# EAGLE design esphome-schalter-icmodul (EAGLE 9.6.2)
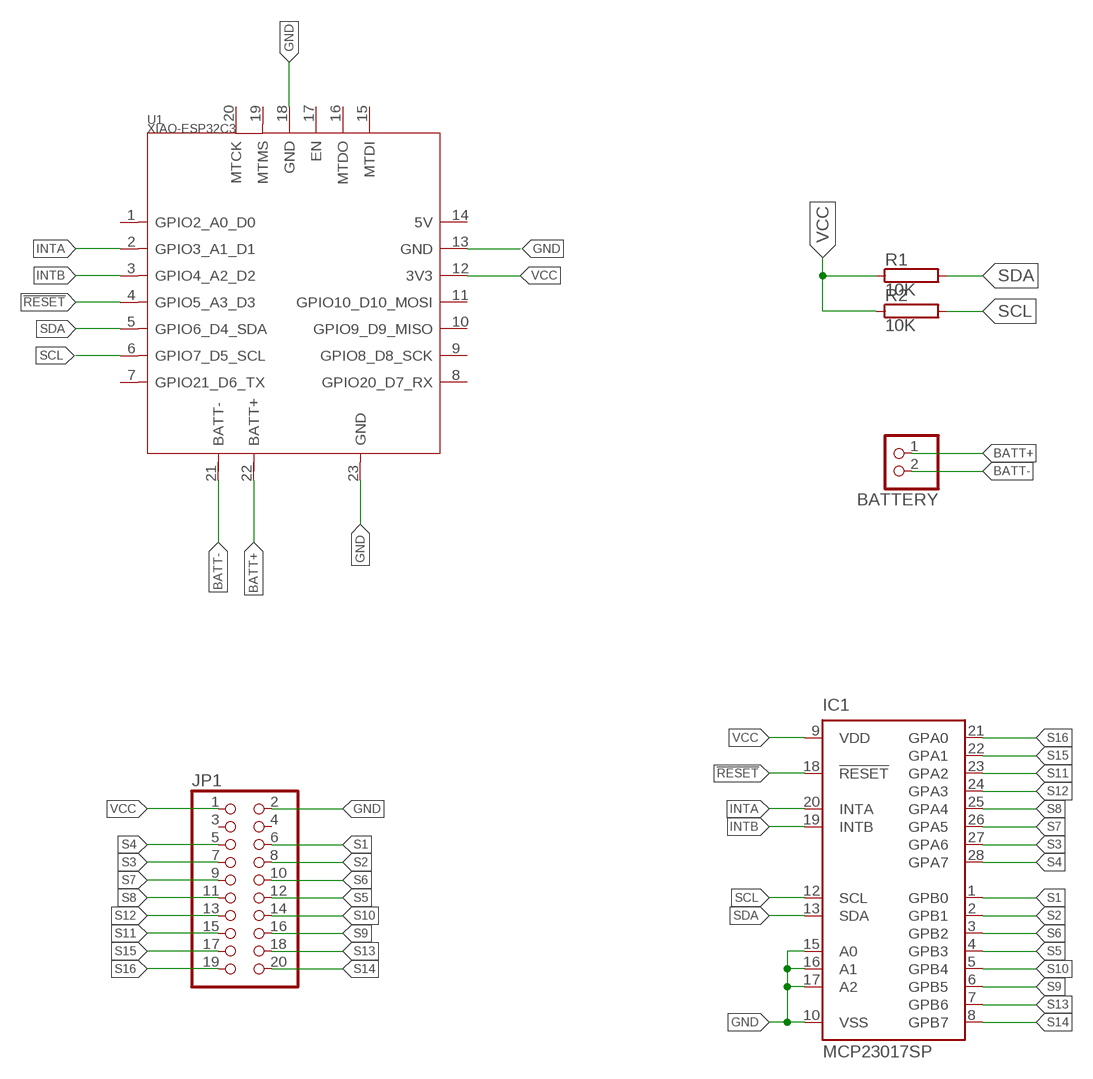
[diagram p0: schematic, sheet 1]

## Parts
BATTERY  JST_2PIN-SMT  [JST-PH-2-SMT]
IC1  MCP23017SP  [DIL28-3]
JP1  PINHD-2X10  [2X10]
R1  10K  RCA0001  [CA0001]
R2  10K  RCA0001  [CA0001]
U1  XIAO-ESP32C3  [XIAO-ESP32C3-MODULE14P-2.54-21X17.8MM]

## Nets
!RESET: IC1.18(!RESET) U1.4(GPIO5_A3_D3)
BATT+: BATTERY.1 U1.22(BATT+)
BATT-: BATTERY.2 U1.21(BATT-)
GND: IC1.10(VSS) IC1.15(A0) IC1.16(A1) IC1.17(A2) JP1.2 U1.13(GND) U1.18(GND) U1.23(GND)
INTA: IC1.20(INTA) U1.2(GPIO3_A1_D1)
INTB: IC1.19(INTB) U1.3(GPIO4_A2_D2)
S1: IC1.1(GPB0) JP1.6
S2: IC1.2(GPB1) JP1.8
S3: IC1.27(GPA6) JP1.7
S4: IC1.28(GPA7) JP1.5
S5: IC1.4(GPB3) JP1.12
S6: IC1.3(GPB2) JP1.10
S7: IC1.26(GPA5) JP1.9
S8: IC1.25(GPA4) JP1.11
S9: IC1.6(GPB5) JP1.16
S10: IC1.5(GPB4) JP1.14
S11: IC1.23(GPA2) JP1.15
S12: IC1.24(GPA3) JP1.13
S13: IC1.7(GPB6) JP1.18
S14: IC1.8(GPB7) JP1.20
S15: IC1.22(GPA1) JP1.17
S16: IC1.21(GPA0) JP1.19
SCL: IC1.12(SCL) R2.2 U1.6(GPIO7_D5_SCL)
SDA: IC1.13(SDA) R1.2 U1.5(GPIO6_D4_SDA)
VCC: IC1.9(VDD) JP1.1 R1.1 R2.1 U1.12(3V3)
Unconnected: JP1.3 JP1.4 U1.1(GPIO2_A0_D0) U1.7(GPIO21_D6_TX) U1.8(GPIO20_D7_RX) U1.9(GPIO8_D8_SCK) U1.10(GPIO9_D9_MISO) U1.11(GPIO10_D10_MOSI) U1.14(5V) U1.15(MTDI) U1.16(MTDO) U1.17(EN) U1.19(MTMS) U1.20(MTCK)

## Library data of the parts
BATTERY = adafruit:JST_2PIN: JST 2-Pin Connectors of various flavors SMT-RA (S2B-PH-SM4) 4UConnector #17311 SMT (B2B-PH-SM4) THM-RA (S2B-PH) THM (B2B-PH)
IC1 = microchip:MCP23017: http://ww1.microchip.com/downloads/en/DeviceDoc/21952a.pdf Source: http://ww1.microchip.com/downloads/en/DeviceDoc/21952a.pdf; MF: MICROCHIP; MPN: MCP23017-E/SP; OC_FARNELL: 1332088; OC_NEWARK: 31K2959
JP1 = pinhead:PINHD-2X10: PIN HEADER
R1 R2 = resistor-power:R: Power Resitor; OC_FARNELL: unknown; OC_NEWARK: unknown
U1 = Seeed Studio XIAO Series:XIAO-ESP32C3: Seeed Studio XIAO ESP32C3 - Espressif ESP32-C3 WiFi BLE Microcontroller - 32-bit 160MHz RISC-V processor Seeed SKU: 113991054 Seeed Studio XIAO ESP32C3 featuring ESP32C3 carries a complete Wi-Fi system along with Bluetooth Low Energy function. With its exquisite design, WiFi+BT ability, it's perfect for various IoT controlling scenarios and complex carriable applications. Buy now <https://www.seeedstudio.com/Seeed-XIAO-ESP32C3-p-5431.html> Wiki <https://wiki.seeedstudio.com/XIAO_ESP32C3_Getting_Started/>

## Board
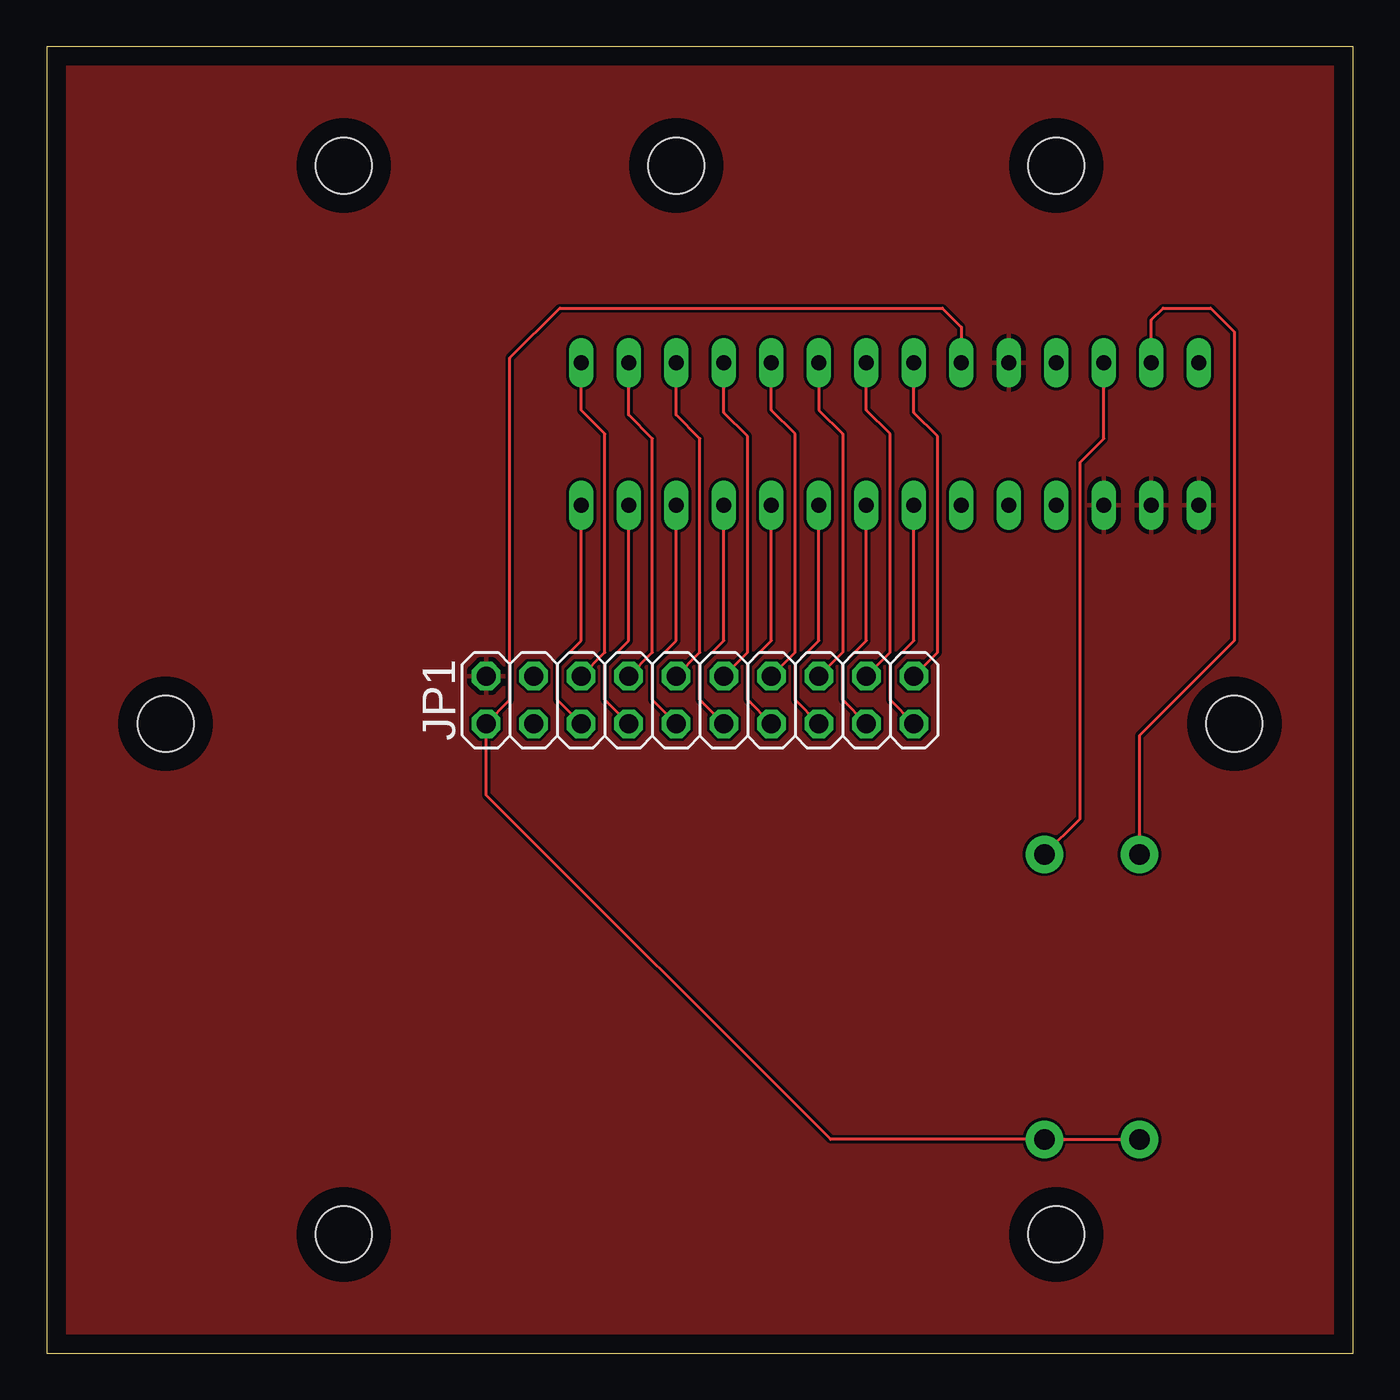
[diagram p1: board, top side]
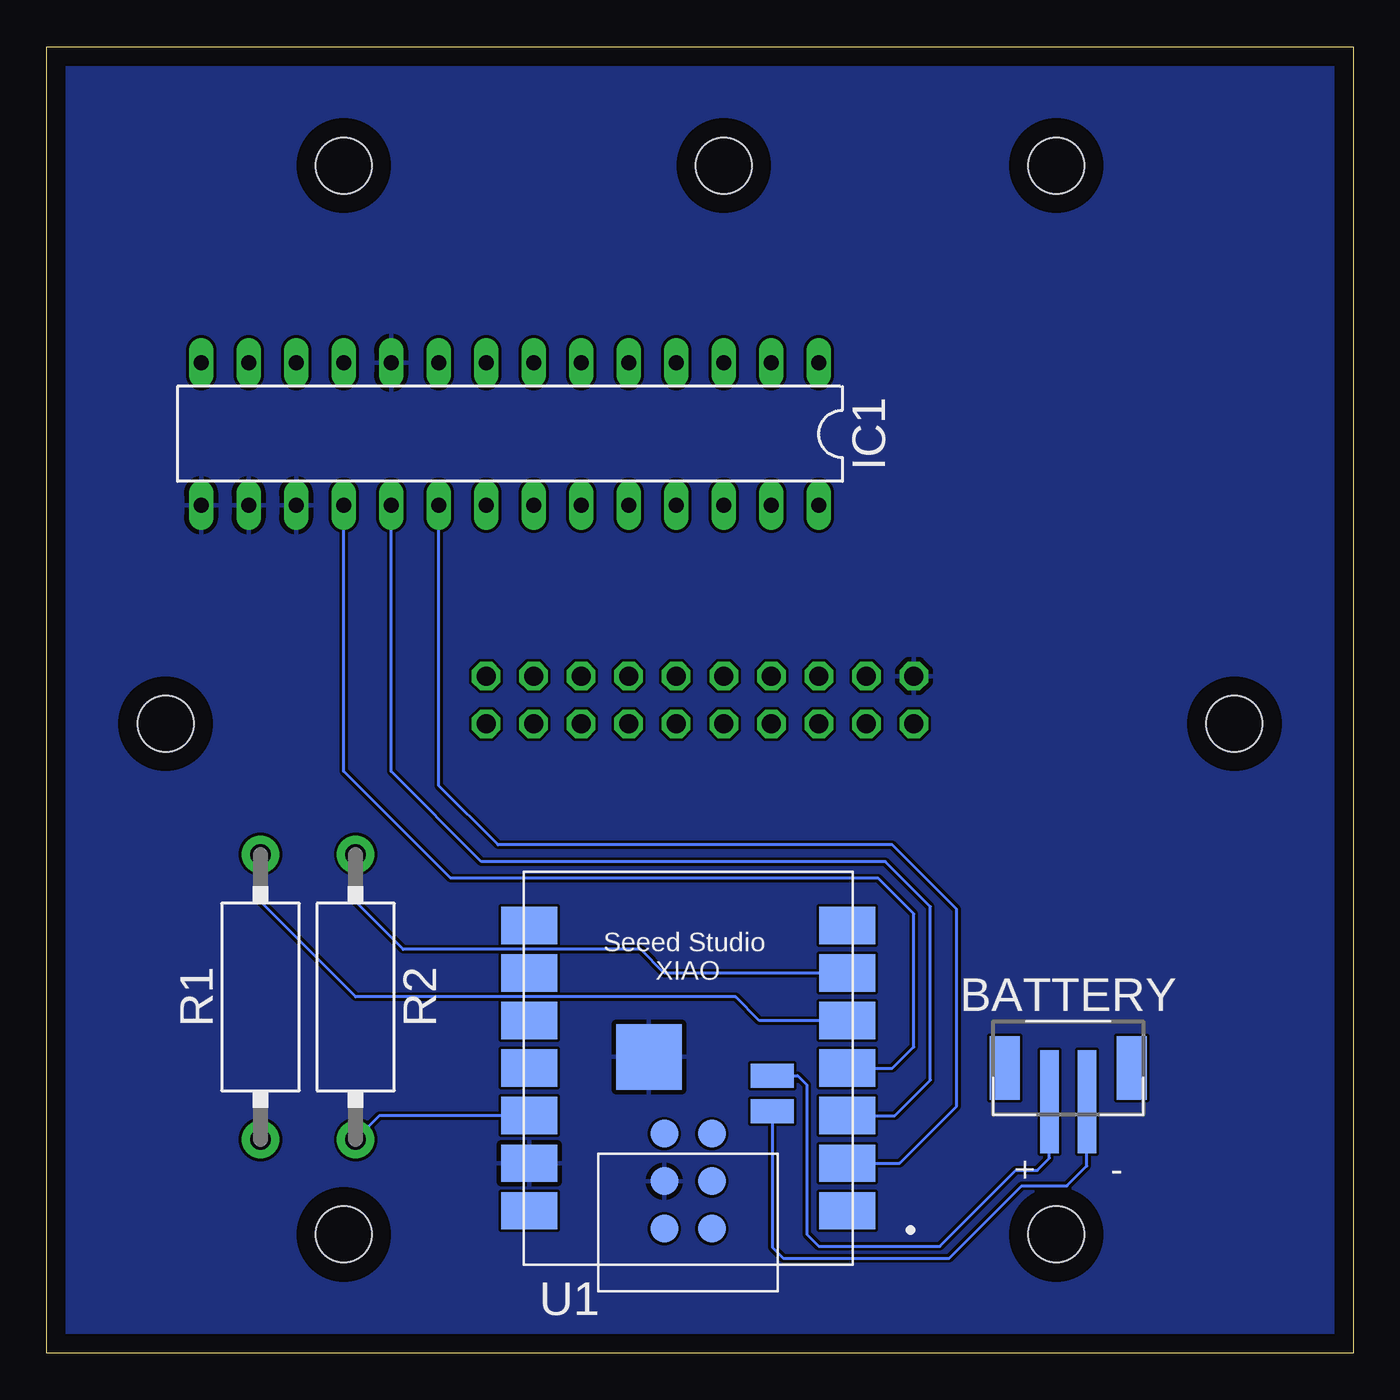
[diagram p2: board, bottom side, seen from below]

Size 69.85 x 69.85 mm. Coordinates in mm from the lower left corner, seen from the top.
Outline: 0,0 69.85,0 69.85,69.85 0,69.85 0,0
Copper layers (1*16): Top 0.035mm / dielectric 1.5mm / Bottom 0.035mm
Design rules "default": minimum track width 6mil, minimum drill 0.35mm, track to track 6mil, track to pad 6mil, pad to pad 6mil, via to via 6mil, smd to smd 6mil, copper to edge 40mil, drill to drill 6mil, minimum pad ring 10mil, minimum via ring 8mil, stop-mask expansion 4mil, vias tented up to drill 0mil, thermal gap 10mil
Holes 3 mm at 15.88,63.5 33.66,63.5 53.98,63.5 6.35,33.66 63.5,33.66 53.98,6.35 15.88,6.35

### Footprints (pad centres in the part's own frame; a part is rotated, then mirrored left to right if it is on the bottom)
JST-PH-2-SMT = smd 1 x 5.5: 1 -1,-1.8; 2 1,-1.8 | smd 1.6 x 3.4: NC1 -3.4,0; NC2 3.4,0
DIL28-3 = drill 0.813 long: 1 -16.51,-3.81; 2 -13.97,-3.81; 3 -11.43,-3.81; 4 -8.89,-3.81; 5 -6.35,-3.81; 6 -3.81,-3.81; 7 -1.27,-3.81; 8 1.27,-3.81; 9 3.81,-3.81; 10 6.35,-3.81; 11 8.89,-3.81; 12 11.43,-3.81; 13 13.97,-3.81; 14 16.51,-3.81; 15 16.51,3.81; 16 13.97,3.81; 17 11.43,3.81; 18 8.89,3.81; 19 6.35,3.81; 20 3.81,3.81; 21 1.27,3.81; 22 -1.27,3.81; 23 -3.81,3.81; 24 -6.35,3.81; 25 -8.89,3.81; 26 -11.43,3.81; 27 -13.97,3.81; 28 -16.51,3.81
2X10 = drill 1.016 octagon: 1 -11.43,-1.27; 2 -11.43,1.27; 3 -8.89,-1.27; 4 -8.89,1.27; 5 -6.35,-1.27; 6 -6.35,1.27; 7 -3.81,-1.27; 8 -3.81,1.27; 9 -1.27,-1.27; 10 -1.27,1.27; 11 1.27,-1.27; 12 1.27,1.27; 13 3.81,-1.27; 14 3.81,1.27; 15 6.35,-1.27; 16 6.35,1.27; 17 8.89,-1.27; 18 8.89,1.27; 19 11.43,-1.27; 20 11.43,1.27
CA0001 = drill 1.1 pad 2: 1 -7.62,0; 2 7.62,0
XIAO-ESP32C3-MODULE14P-2.54-21X17.8MM = smd 3 x 2: 1 -8.5,7.62; 2 -8.5,5.08; 3 -8.5,2.54; 4 -8.5,0; 5 -8.5,-2.54; 6 -8.5,-5.08; 7 -8.5,-7.62; 8 8.5,-7.62; 9 8.5,-5.08; 10 8.5,-2.54; 11 8.5,0; 12 8.5,2.54; 13 8.5,5.08; 14 8.5,7.62 | smd 1.5 x 1.5: 15 -1.27,8.58; 16 1.27,8.58; 17 -1.27,6.04; 18 1.27,6.04; 19 -1.27,3.5; 20 1.27,3.5 | smd 2.3 x 1.3: 21 -4.5,2.3; 22 -4.5,0.4 | smd 3.5 x 3.5: 23 2.1,-0.6

### Placement (x,y rotation side)
BATTERY  15.24,15.24 0 bottom
IC1  45.09,49.15 180 bottom
JP1  34.92,34.92 0 top
R1  58.42,19.05 90 bottom
R2  53.34,19.05 90 bottom
U1  35.56,15.24 180 bottom

### Tracks (layer width: path | path; a pad name or v marks a point on that pad's centre or on a via)
!RESET
  Bottom 0.152: U1.4 24.64,15.24 23.5,16.38 23.5,23.5 25.4,25.4 48.26,25.4 53.98,31.11 IC1.18
BATT+
  Bottom 0.152: U1.22 29.7,14.84 29.21,14.35 29.21,6.35 28.57,5.71 22.1,5.71 18.03,9.78 16.89,9.78 16.24,10.43 BATTERY.1
BATT-
  Bottom 0.152: U1.21 31.06,5.66 30.48,5.08 21.59,5.08 17.73,8.94 15.31,8.94 14.24,10.02 BATTERY.2
GND
  pour Top: 0,0 0,69.85 69.85,69.85 69.85,0
  pour Bottom: 0,0 0,69.85 69.85,69.85 69.85,0
INTA
  Bottom 0.152: U1.2 24.26,10.16 21.21,13.21 21.21,23.75 24.64,27.18 45.72,27.18 48.9,30.35 IC1.20
INTB
  Bottom 0.152: U1.3 24.51,12.7 22.61,14.61 22.61,23.88 25.02,26.29 46.61,26.29 51.44,31.11 IC1.19
S1
  Top 0.152: JP1.6 29.84,37.47 29.84,49.15 28.57,50.42 IC1.1
S2
  Top 0.152: JP1.8 32.38,37.47 32.38,48.9 31.11,50.16 IC1.2
S3
  Top 0.152: JP1.7 29.84,34.92 29.84,36.83 31.11,38.1 IC1.27
S4
  Top 0.152: JP1.5 27.3,34.92 27.3,36.83 28.57,38.1 IC1.28
S5
  Top 0.152: JP1.12 37.47,37.47 37.47,49.02 36.2,50.29 IC1.4
S6
  Top 0.152: JP1.10 34.92,37.47 34.92,48.9 33.66,50.16 IC1.3
S7
  Top 0.152: JP1.9 32.38,34.92 32.38,36.83 33.66,38.1 IC1.26
S8
  Top 0.152: JP1.11 34.92,34.92 34.92,36.83 36.2,38.1 IC1.25
S9
  Top 0.152: IC1.6 41.27,50.42 42.55,49.15 42.55,37.47 JP1.16
S10
  Top 0.152: JP1.14 40.01,37.47 40.01,49.15 38.73,50.42 IC1.5
S11
  Top 0.152: JP1.15 40.01,34.92 40.01,36.83 41.27,38.1 IC1.23
S12
  Top 0.152: JP1.13 37.47,34.92 37.47,36.83 38.73,38.1 IC1.24
S13
  Top 0.152: JP1.18 45.09,37.47 45.09,49.15 43.81,50.42 IC1.7
S14
  Top 0.152: JP1.20 47.62,37.47 47.62,49.02 46.35,50.29 IC1.8
S15
  Top 0.152: JP1.17 42.55,34.92 42.55,36.83 43.81,38.1 IC1.22
S16
  Top 0.152: JP1.19 45.09,34.92 45.09,36.83 46.35,38.1 IC1.21
SCL
  Top 0.152: IC1.12 56.52,48.9 55.24,47.62 55.24,28.57 R2.2
  Bottom 0.152: U1.6 36.83,20.32 38.1,21.59 50.8,21.59 53.34,24.13 R2.2
SDA
  Top 0.152: IC1.13 59.05,55.24 59.69,55.88 62.23,55.88 63.5,54.61 63.5,38.1 58.42,33.02 R1.2
  Bottom 0.152: U1.5 31.75,17.78 33.02,19.05 53.34,19.05 58.42,24.13 R1.2
VCC
  Top 0.152: R1.1 R2.1 41.91,11.43 23.5,29.84 JP1.1 24.77,34.92 24.77,53.21 27.43,55.88 47.88,55.88 48.9,54.86 IC1.9
  Bottom 0.152: U1.12 52.07,12.7 R2.1